# Altium schematic sheet DualDriver.SchDoc
size Letter
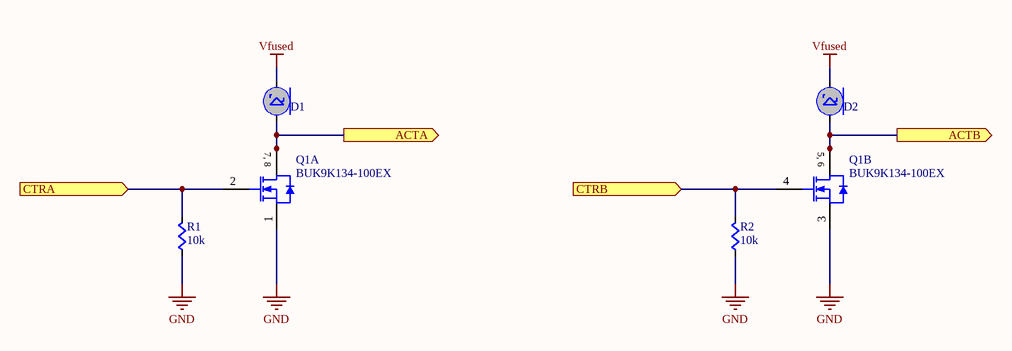
[diagram p0: DualDriver.SchDoc]

## Parts
D1  Schottky  [SS110-TP]  (value not drawn)
D2  Schottky  [SS110-TP]  (value not drawn)
Q1  BUK9K134-100EX  [NXP_SOT1205]  (parts A,B of 2)
R1  value 10k  [RES0603]  (hidden comment: Res)
R2  value 10k  [RES0603]  (hidden comment: Res)

## Ports
ACTA (out), ACTB (out), CTRA (in), CTRB (in)

## Nets
GND: Q1.1(S) Q1.3(S) R1.2(B) R2.2(B)
Vfused: D1.C D2.C
ACTA: D1.A Q1.7(D) Q1.8(D) ; port ACTA
ACTB: D2.A Q1.5(D) Q1.6(D) ; port ACTB
CTRA: Q1.2(G) R1.1(A) ; port CTRA
CTRB: Q1.4(G) R2.1(A) ; port CTRB

## Notes on the sheet
- (in symbol BUK9K134-100EX, part A) 7, 8
- (in symbol BUK9K134-100EX, part B) 5, 6

## Library data of the parts
D1 D2 = Schottky: Schottky Diode Template; Supplier 1: Digi-Key; Supplier Part Number 1: B1100-FDICT-ND
Q1 = BUK9K134-100EX: MOSFET DUAL N-CH 100V 8.5A SOT1205; Supplier 1: Digi-Key; Supplier Part Number 1: 568-11631-1-ND
R1 R2 = Res: Supplier 1: Digi-Key; Supplier Part Number 1: 311-10.0KHRCT-ND